# Altium schematic sheet Power_Diagram.SchDoc
size A4; SheetNumber: 1; SheetTotal: 5
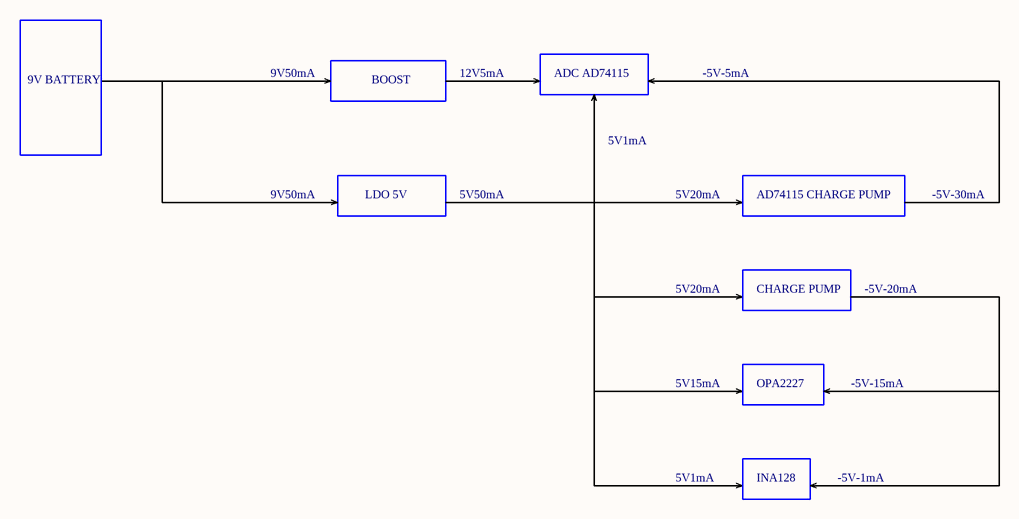
[diagram p0: Power_Diagram.SchDoc]

## Notes on the sheet
- 9V BATTERY
- 9V50mA
- BOOST
- 12V5mA
- ADC AD74115
- -5V-5mA
- 5V1mA
- LDO 5V
- 5V50mA
- 5V20mA
- AD74115 CHARGE PUMP
- -5V-30mA
- CHARGE PUMP
- -5V-20mA
- 5V15mA
- OPA2227
- -5V-15mA
- INA128
- -5V-1mA